# Altium schematic sheet HDMI_IN.SchDoc
size C
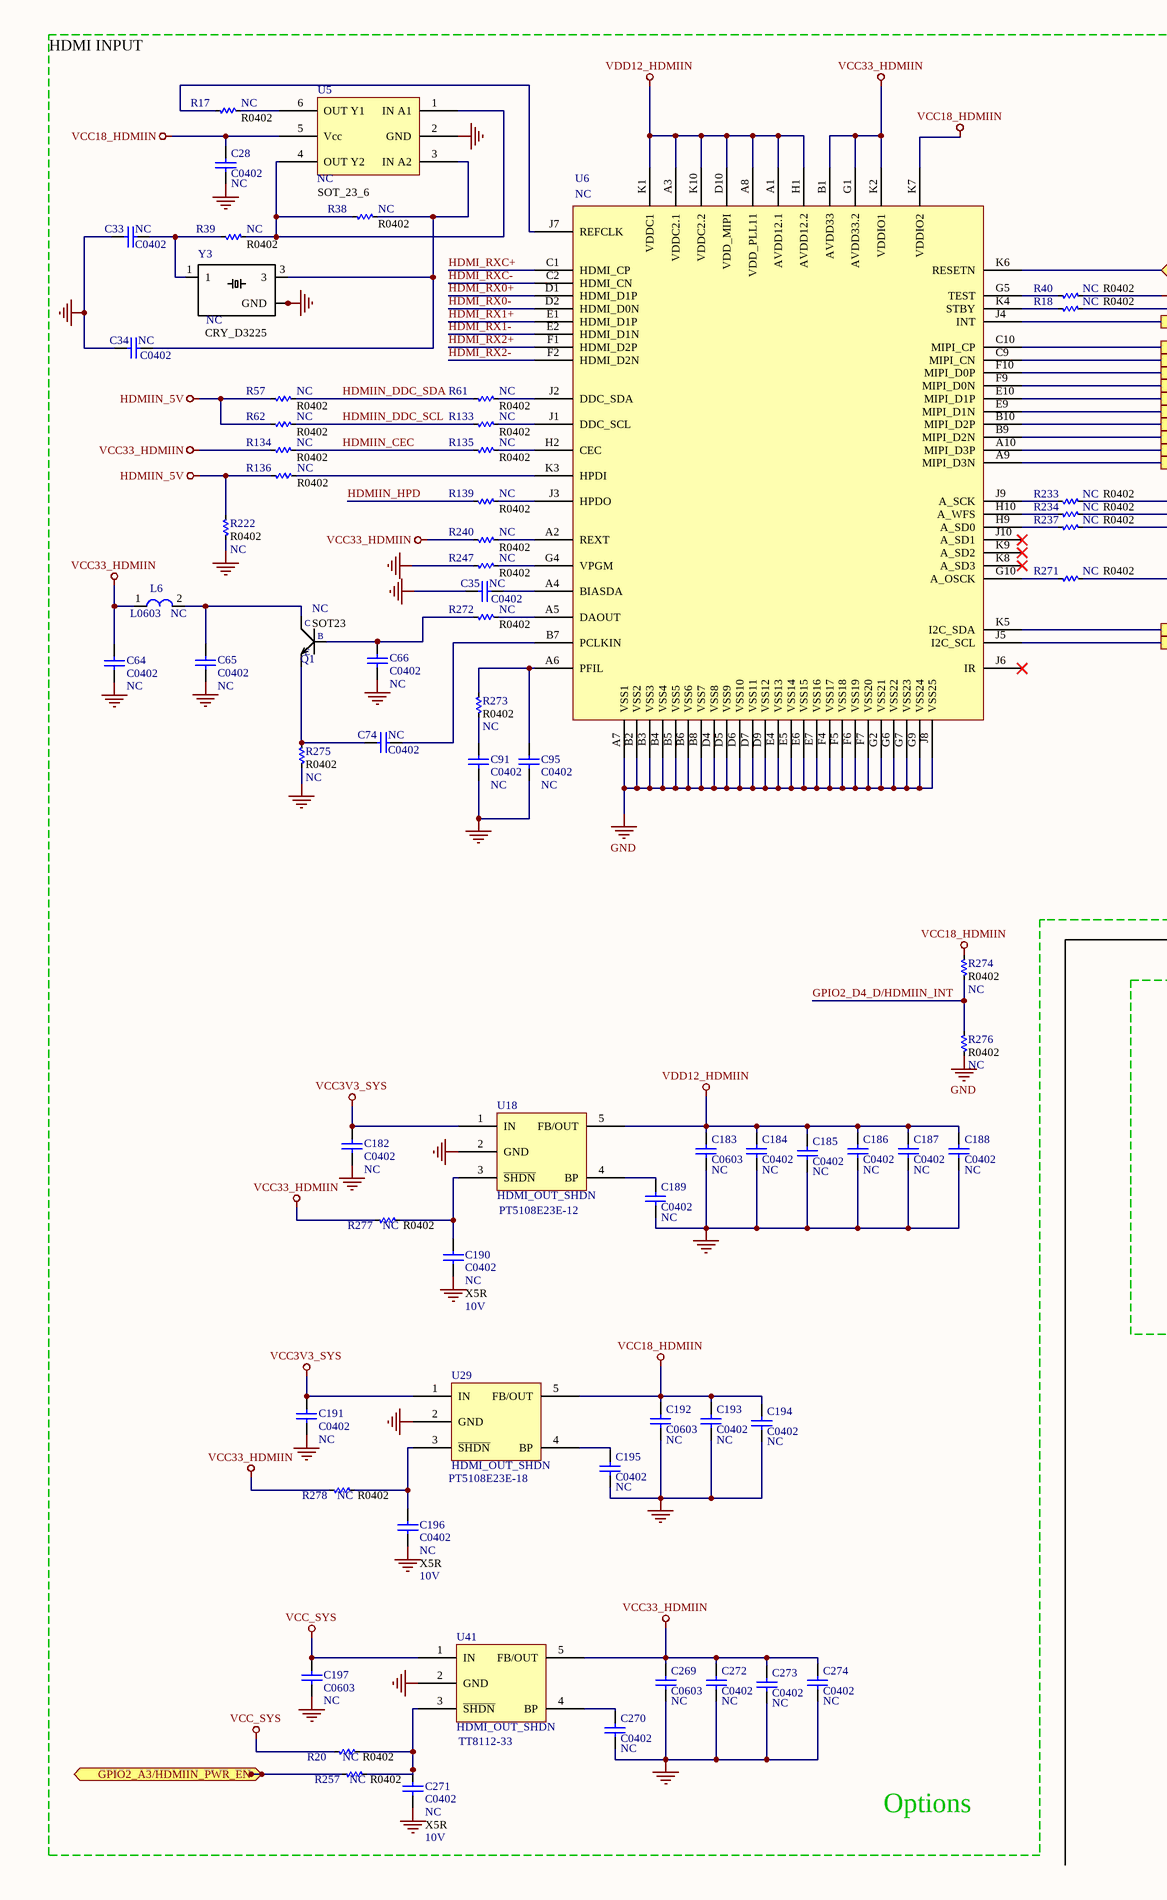
[diagram p0: HDMI_IN.SchDoc, left]
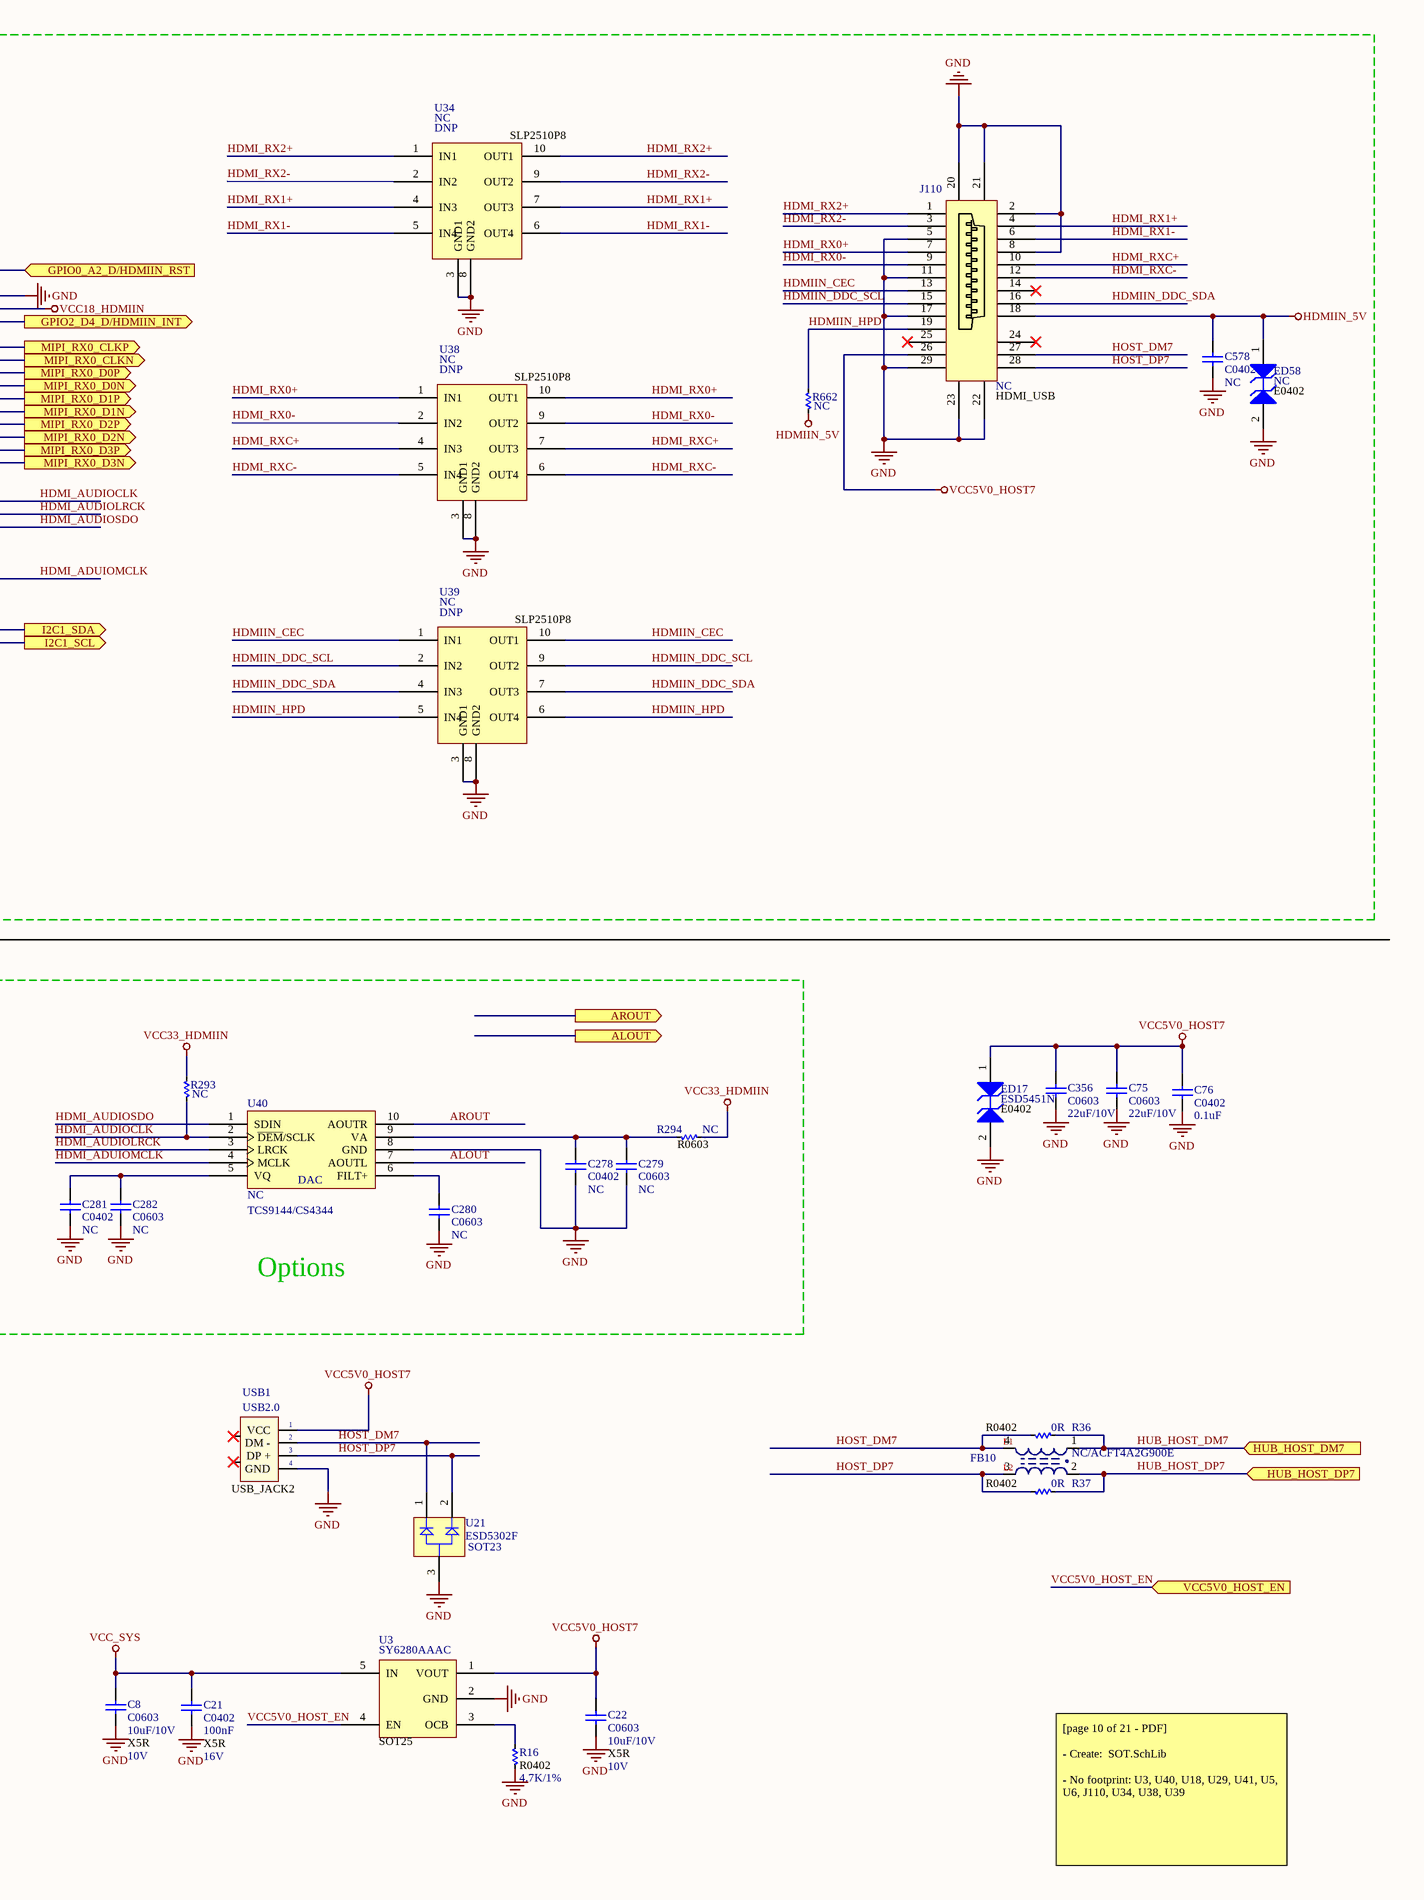
[diagram p1: HDMI_IN.SchDoc, right]

## Parts
C8  C0603  value 10uF/10V  [C 0603]
C21  C0402  value 100nF  [C 0402]
C22  C0603  value 10uF/10V  [C 0603]
C28  C0402  value NC  [C 0402]
C33  C0402  value NC  [C 0402]
C34  C0402  value NC  [C 0402]
C35  C0402  value NC  [C 0402]
C64  C0402  value NC  [C 0402]
C65  C0402  value NC  [C 0402]
C66  C0402  value NC  [C 0402]
C74  C0402  value NC  [C 0402]
C75  C0603  value 22uF/10V  [C 0603]
C76  C0402  value 0.1uF  [C 0402]
C91  C0402  value NC  [C 0402]
C95  C0402  value NC  [C 0402]
C182  C0402  value NC  [C 0402]
C183  C0603  value NC  [C 0603]
C184  C0402  value NC  [C 0402]
C185  C0402  value NC  [C 0402]
C186  C0402  value NC  [C 0402]
C187  C0402  value NC  [C 0402]
C188  C0402  value NC  [C 0402]
C189  C0402  value NC  [C 0402]
C190  C0402  value NC  [C 0402]
C191  C0402  value NC  [C 0402]
C192  C0603  value NC  [C 0603]
C193  C0402  value NC  [C 0402]
C194  C0402  value NC  [C 0402]
C195  C0402  value NC  [C 0402]
C196  C0402  value NC  [C 0402]
C197  C0603  value NC  [C 0603]
C269  C0603  value NC  [C 0603]
C270  C0402  value NC  [C 0402]
C271  C0402  value NC  [C 0402]
C272  C0402  value NC  [C 0402]
C273  C0402  value NC  [C 0402]
C274  C0402  value NC  [C 0402]
C278  C0402  value NC  [C 0402]
C279  C0603  value NC  [C 0603]
C280  C0603  value NC  [C 0603]
C281  C0402  value NC  [C 0402]
C282  C0603  value NC  [C 0603]
C356  C0603  value 22uF/10V  [C 0603]
C578  C0402  value NC  [C 0402]
ED17  ESD5451N  [DFN1006-2L]
ED58  ESD5451N  [DFN1006-2L]  (value not drawn)
FB10  RP2_0405  [L-SMD-D-7.3x7.3]  (value not drawn)
J110  HDMI_USB  value NC
L6  L0603  Inductance: NC  [L-SMD-M-12x10]
Q1  value NC  [*SOT-23]  (hidden comment: 8050)
R16  R0402  value 4.7K/1%  [R 0402]
R17  R0402  value NC  [R 0402]
R18  R0402  value NC  [R 0402]
R20  R0402  value NC  [R 0402]
R36  R0402  value 0R  [R 0402]
R37  R0402  value 0R  [R 0402]
R38  R0402  value NC  [R 0402]
R39  R0402  value NC  [R 0402]
R40  R0402  value NC  [R 0402]
R57  R0402  value NC  [R 0402]
R61  R0402  value NC  [R 0402]
R62  R0402  value NC  [R 0402]
R133  R0402  value NC  [R 0402]
R134  R0402  value NC  [R 0402]
R135  R0402  value NC  [R 0402]
R136  R0402  value NC  [R 0402]
R139  R0402  value NC  [R 0402]
R222  R0402  value NC  [R 0402]
R233  R0402  value NC  [R 0402]
R234  R0402  value NC  [R 0402]
R237  R0402  value NC  [R 0402]
R240  R0402  value NC  [R 0402]
R247  R0402  value NC  [R 0402]
R257  R0402  value NC  [R 0402]
R271  R0402  value NC  [R 0402]
R272  R0402  value NC  [R 0402]
R273  R0402  value NC  [R 0402]
R274  R0402  value NC  [R 0402]
R275  R0402  value NC  [R 0402]
R276  R0402  value NC  [R 0402]
R277  R0402  value NC  [R 0402]
R278  R0402  value NC  [R 0402]
R293  value NC  [R 0402]  (hidden comment: R0402)
R294  R0603  value NC  [R 0603]
R662  value NC  [R 0402]  (hidden comment: R0402)
U3  SY6280AAAC  Package: SOT25  [DCK5_N]
U5  value NC  Package: SOT_23_6  [SOT-23-6]  (hidden comment: HDMI_IN_SOT236)
U6  value NC  [TC358749XBG-80pin]  (hidden comment: HDMI_IN)
U18  HDMI_OUT_SHDN  [TI-DDC5_N]
U21  ESD5302F  PackageReference: SOT23  [INF-SOT23_N]
U29  HDMI_OUT_SHDN  [TI-DDC5_N]
U34  NC  [RCLAMP0524PATCT]
U38  NC  [RCLAMP0524PATCT]
U39  NC  [RCLAMP0524PATCT]
U40  DAC  value NC  [TSSOP-10]
U41  HDMI_OUT_SHDN  [TI-DDC5_N]
USB1  value USB2.0  [USB-S1]  (hidden comment: USB-S)
Y3  NC  [Crystal 4-SMD 32x25]

## Blocks framed on the sheet
Options: C28 C33-C35 C64-C66 C74 C91 C95 C182-C197 C269-C274 C578 ED58 J110 L6 Q1 R17 R18 R20 R38-R40 R57 R61 R62 R133-R136 R139 R222 R233 R234 R237 R240 R247 R257 R271-R278 R662 U5 U6 U18 U29 U34 U38 U39 U41 Y3
Options: C278-C282 R293 R294 U40

## Ports
ALOUT (out), AROUT (out), GPIO0_A2_D/HDMIIN_RST (in), GPIO2_A3/HDMIIN_PWR_EN (in), GPIO2_D4_D/HDMIIN_INT (out), HUB_HOST_DM7 (in), HUB_HOST_DP7 (in), I2C1_SCL (out), I2C1_SDA (out), MIPI_RX0_CLKN (out), MIPI_RX0_CLKP (out), MIPI_RX0_D0N (out), MIPI_RX0_D0P (out), MIPI_RX0_D1N (out), MIPI_RX0_D1P (out), MIPI_RX0_D2N (out), MIPI_RX0_D2P (out), MIPI_RX0_D3N (out), MIPI_RX0_D3P (out), VCC5V0_HOST_EN (in)

## Nets
GND: C8.2 C21.2 C22.2 C28.2 C33.1 C34.1 C35.1 C64.1 C65.1 C66.1 C75.2 C76.2 C91.1 C95.1 C182.2 C183.2 C184.2 C185.2 C186.2 C187.2 C188.2 C189.2 C190.2 C191.2 C192.2 C193.2 C194.2 C195.2 C196.2 C197.2 C269.2 C270.2 C271.2 C272.2 C273.2 C274.2 C278.2 C279.2 C280.2 C281.2 C282.2 C356.2 C578.2 ED17.2(A2) ED58.2(A2) J110.2 J110.5 J110.8 J110.11 J110.17 J110.20 J110.21 J110.22 J110.23 J110.29 R16.1 R40.2 R222.1 R247.1 R275.1 R276.2 U3.2(GND) U5.2(GND) U6.A7(VSS1) U6.B2(VSS2) U6.B3(VSS3) U6.B4(VSS4) U6.B5(VSS5) U6.B6(VSS6) U6.B8(VSS7) U6.D4(VSS8) U6.D5(VSS9) U6.D6(VSS10) U6.D7(VSS11) U6.D9(VSS12) U6.E4(VSS13) U6.E5(VSS14) U6.E6(VSS15) U6.E7(VSS16) U6.F4(VSS17) U6.F5(VSS18) U6.F6(VSS19) U6.F7(VSS20) U6.G2(VSS21) U6.G6(VSS22) U6.G7(VSS23) U6.G9(VSS24) U6.J8(VSS25) U18.2(GND) U21.3(A) U29.2(GND) U34.3(GND1) U34.8(GND2) U38.3(GND1) U38.8(GND2) U39.3(GND1) U39.8(GND2) U40.8(GND) U41.2(GND) USB1.4(GND) Y3.2(GND) Y3.4(GND)
HDMIIN_5V: C578.1 ED58.1(A1) J110.18 R57.1 R62.1 R136.1 R222.2 R662.1
VCC3V3_SYS: C182.1 C191.1 U18.1(IN) U29.1(IN)
VCC5V0_HOST7: C22.1 C75.1 C76.1 C356.1 ED17.1(A1) J110.26 U3.1(VOUT) USB1.1(VCC)
VCC18_HDMIIN: C28.1 C192.1 C193.1 C194.1 R18.2 R274.1 U5.5(Vcc) U6.K7(VDDIO2) U29.5(FB/OUT)
VCC33_HDMIIN: C64.2 C269.1 C272.1 C273.1 C274.1 L6.1 R134.1 R240.1 R277.2 R278.2 R293.2 R294.1 U6.B1(AVDD33) U6.G1(AVDD33.2) U6.K2(VDDIO1) U41.5(FB/OUT)
VCC_SYS: C8.1 C21.1 C197.1 R20.2 U3.5(IN) U41.1(IN)
VDD12_HDMIIN: C183.1 C184.1 C185.1 C186.1 C187.1 C188.1 U6.A1(AVDD12.1) U6.A3(VDDC2.1) U6.A8(VDD_PLL11) U6.D10(VDD_MIPI) U6.H1(AVDD12.2) U6.K1(VDDC1) U6.K10(VDDC2.2) U18.5(FB/OUT)
ALOUT: U40.7(AOUTL)
AROUT: U40.10(AOUTR)
GPIO0_A2_D/HDMIIN_RST: U6.K6(RESETN) ; port GPIO0_A2_D/HDMIIN_RST
GPIO2_A3/HDMIIN_PWR_EN: R257.2 ; port GPIO2_A3/HDMIIN_PWR_EN
GPIO2_D4_D/HDMIIN_INT: U6.J4(INT) ; port GPIO2_D4_D/HDMIIN_INT
GPIO2_D4_D/HDMIIN_INT: R274.2 R276.1  [a separate net that carries the same name]
HDMI_ADUIOMCLK: R271.2 U40.4(MCLK)
HDMI_AUDIOCLK: R233.2 R293.1 U40.2(~{DEM}/SCLK)
HDMI_AUDIOLRCK: R234.2 U40.3(LRCK)
HDMI_AUDIOSDO: R237.2 U40.1(SDIN)
HDMI_RX0+: J110.7 U6.D1(HDMI_D1P) U38.1(IN1) U38.10(OUT1)
HDMI_RX0-: J110.9 U6.D2(HDMI_D0N) U38.2(IN2) U38.9(OUT2)
HDMI_RX1+: J110.4 U6.E1(HDMI_D1P) U34.4(IN3) U34.7(OUT3)
HDMI_RX1-: J110.6 U6.E2(HDMI_D1N) U34.5(IN4) U34.6(OUT4)
HDMI_RX2+: J110.1 U6.F1(HDMI_D2P) U34.1(IN1) U34.10(OUT1)
HDMI_RX2-: J110.3 U6.F2(HDMI_D2N) U34.2(IN2) U34.9(OUT2)
HDMI_RXC+: J110.10 U6.C1(HDMI_CP) U38.4(IN3) U38.7(OUT3)
HDMI_RXC-: J110.12 U6.C2(HDMI_CN) U38.5(IN4) U38.6(OUT4)
HDMIIN_CEC: J110.13 R134.2 R135.1 U39.1(IN1) U39.10(OUT1)
HDMIIN_DDC_SCL: J110.15 R62.2 R133.1 U39.2(IN2) U39.9(OUT2)
HDMIIN_DDC_SDA: J110.16 R57.2 R61.1 U39.4(IN3) U39.7(OUT3)
HDMIIN_HPD: J110.19 R139.1 R662.2 U39.5(IN4) U39.6(OUT4)
HOST_DM7: FB10.4 J110.27 R36.1 U21.1(K1) USB1.2(DM_-)
HOST_DP7: FB10.3 J110.28 R37.1 U21.2(K2) USB1.3(DP_+)
HUB_HOST_DM7: FB10.1 R36.2 ; port HUB_HOST_DM7
HUB_HOST_DP7: FB10.2 R37.2 ; port HUB_HOST_DP7
I2C1_SCL: U6.J5(I2C_SCL) ; port I2C1_SCL
I2C1_SDA: U6.K5(I2C_SDA) ; port I2C1_SDA
MIPI_RX0_CLKN: U6.C9(MIPI_CN) ; port MIPI_RX0_CLKN
MIPI_RX0_CLKP: U6.C10(MIPI_CP) ; port MIPI_RX0_CLKP
MIPI_RX0_D0N: U6.F9(MIPI_D0N) ; port MIPI_RX0_D0N
MIPI_RX0_D0P: U6.F10(MIPI_D0P) ; port MIPI_RX0_D0P
MIPI_RX0_D1N: U6.E9(MIPI_D1N) ; port MIPI_RX0_D1N
MIPI_RX0_D1P: U6.E10(MIPI_D1P) ; port MIPI_RX0_D1P
MIPI_RX0_D2N: U6.B9(MIPI_D2N) ; port MIPI_RX0_D2N
MIPI_RX0_D2P: U6.B10(MIPI_D2P) ; port MIPI_RX0_D2P
MIPI_RX0_D3N: U6.A9(MIPI_D3N) ; port MIPI_RX0_D3N
MIPI_RX0_D3P: U6.A10(MIPI_D3P) ; port MIPI_RX0_D3P
VCC5V0_HOST_EN: U3.4(EN) ; port VCC5V0_HOST_EN
NetC33_2: C33.2 R39.1 Y3.1
NetC34_2: C34.2 R38.2 U5.3(IN_A2) Y3.3
NetC35_2: C35.2 U6.A4(BIASDA)
NetC65_2: C65.2 L6.2 Q1.3(C)
NetC66_2: C66.2 Q1.1(B) R272.1
NetC74_1: C74.1 U6.B7(PCLKIN)
NetC74_2: C74.2 Q1.2(E) R275.2
NetC91_2: C91.2 R273.1
NetC95_2: C95.2 R273.2 U6.A6(PFIL)
NetC189_1: C189.1 U18.4(BP)
NetC190_1: C190.1 R277.1 U18.3(~{SHDN})
NetC195_1: C195.1 U29.4(BP)
NetC196_1: C196.1 R278.1 U29.3(~{SHDN})
NetC270_1: C270.1 U41.4(BP)
NetC271_1: C271.1 R20.1 R257.1 U41.3(~{SHDN})
NetC278_1: C278.1 C279.1 R294.2 U40.9(VA)
NetC280_1: C280.1 U40.6(FILT+)
NetC281_1: C281.1 C282.1 U40.5(VQ)
NetR16_2: R16.2 U3.3(OCB)
NetR17_1: R17.1 U6.J7(REFCLK)
NetR17_2: R17.2 U5.6(OUT_Y1)
NetR18_1: R18.1 U6.K4(STBY)
NetR38_1: R38.1 R39.2 U5.1(IN_A1) U5.4(OUT_Y2)
NetR40_1: R40.1 U6.G5(TEST)
NetR61_2: R61.2 U6.J2(DDC_SDA)
NetR133_2: R133.2 U6.J1(DDC_SCL)
NetR135_2: R135.2 U6.H2(CEC)
NetR136_2: R136.2 U6.K3(HPDI)
NetR139_2: R139.2 U6.J3(HPDO)
NetR233_1: R233.1 U6.J9(A_SCK)
NetR234_1: R234.1 U6.H10(A_WFS)
NetR237_1: R237.1 U6.H9(A_SD0)
NetR240_2: R240.2 U6.A2(REXT)
NetR247_2: R247.2 U6.G4(VPGM)
NetR271_1: R271.1 U6.G10(A_OSCK)
NetR272_2: R272.2 U6.A5(DAOUT)

Not connected (* = marked no-connect by the designer): J110 14* 24* 25*; U6 J6(IR)* J10(A_SD1)* K8(A_SD3)* K9(A_SD2)*; USB1 5* 6*

## Notes on the sheet
- HDMI INPUT
- [page 10 of 21 - PDF]
  - Create:  SOT.SchLib
  - No footprint: U3, U40, U18, U29, U41, U5, U6, J110, U34, U38, U39
- (in symbol 1SMB54CAT3) E0402; NC
- (in symbol ABM8-30.000MHZ-10-1-U-T) CRY_D3225
- (in symbol Cap) X5R; 10V; 16V
- (in symbol HDMI_OUT_DAC) TCS9144/CS4344
- (in symbol HDMI_OUT_SHDN) PT5108E23E-12; PT5108E23E-18; TT8112-33
- (in symbol L-SMD-2) L1; NC/ACFT4A2G900E; L2
- (in symbol SLP2510P8) DNP
- (in symbol SMD-TRANSISTORS-NPN-25V-500MW(SOT-23)) SOT23
- (in symbol USB_S) USB_JACK2

## Library data of the parts
C8 C21 C22 C28 C33-C35 C64-C66 C74-C76 C91 C95 C182-C197 C269-C274 C278-C282 C356 C578 = Cap: Capacitor; Published: 8-Jun-2000; LatestRevisionDate: 17-Jul-2002; LatestRevisionNote: Re-released for DXP Platform.; PackageReference: RAD-0.3; Publisher: Altium Limited; PackageDescription: Radial Cap, Thru-Hole; 2 Leads; 0.3 in Pin Spacing
ED17 ED58 = 1SMB54CAT3: 600 W Peak Power Zener Transient Voltage Suppressor, Bidirectional, 2-Pin SMB, Tape and Reel; Manufacturer: On Semiconductor; IR Max (uA): 5; PPK Max (W): 600; V(BR) Typ (V): 63.16; DatasheetVersion: Rev. A; PackageVersion: Rev. A, 01/2000; PackageReference: SMB-2-403C-01; PackageDescription: 2-Pin Small Molded Package, J-Bend Lead, Body 4.315 x 3.555 mm; Supplier 1: Digi-Key; Supplier Part Number 1: 1SMB54CAT3-ND; Direction: Bidirectional; Packing: Tape and Reel; Mounting Technology: Surface Mount; PartNumber: 1SMB54CAT3; ComponentLink1Description: Manufacturer URL; ComponentLink1URL: http://www.onsemi.com/; ComponentLink2Description: Datasheet; ComponentLink2URL: http://www.onsemi.com/pub_link/Collateral/1SMB10CAT3-D.PDF; ComponentLink3Description: Package Specification; ComponentLink3URL: http://www.onsemi.com/pub_link/Collateral/1SMB10CAT3-D.PDF
FB10 = L-SMD-2: partNo: 7448709022; Manufacturer: Würth Elektronik eiSos GmbH; Inductance: 2.20 µH; ComponentLink1Description: Manufacturer; ComponentLink1URL: http://www.we-online.de; Created by: Christin Otto; Created Date: August 2013; ComponentLink2Description: Datasheet; ComponentLink2URL: http://katalog.we-online.de/pbs/datasheet/7448709022.pdf
J110 = HDMI_IN_USB
L6 = L-SMD-1: partNo: 78477010; Manufacturer: Wurth Elektronik; ComponentLink1Description: Manufacturer; ComponentLink1URL: http://www.we-online.de; Created by: Baojun Chen; Created Date: Nov.2015; ComponentLink2Description: Datasheet; ComponentLink2URL: http://katalog.we-online.de/pbs/datasheet/78477010.pdf
Q1 = SMD-TRANSISTORS-NPN-25V-500MW(SOT-23): MF: Recom Power; MP: S8050; Package: SMD-8 Samsung; Price: None; SnapEDA_Link: https://www.snapeda.com/parts/S8050/Recom%20Power/view-part/?ref=snap; Availability: Unavailable
R16-R18 R20 R36-R40 R57 R61 R62 R133-R136 R139 R222 R233 R234 R237 R240 R247 R257 R271-R278 R293 R294 R662 = Res-SMD: Resistor; Manufacturer: Generic Components; Class: Passive; Published: 08/06/2000; Publisher: Altium Hobart Technology Centre
U21 = BAS70-06: Silicon Schottky Diode, -55 to 125 degC, SOT23, Reel, Green; Manufacturer: Infineon; Configuration: Dual; CT (max): 2 pF; Green: TRUE; IF (max): 70 mA; VF (max): 1,000 mV; VR (max): 70 V; PackageVersion: Apr-08; PackageDescription: 3-Pin Small Outline Transistor Package, 1.3 x 2.9 mm Body, 0.95 mm Pitch; Packing: Reel; Mounting Technology: Surface Mount; PartNumber: BAS70-06; ComponentLink1Description: Manufacturer URL; ComponentLink1URL: http://www.infineon.com/; ComponentLink2Description: Datasheet; ComponentLink2URL: http://www.infineon.com/dgdl/bas70_bas170series.pdf?folderId=db3a30431400ef68011425f1ca2505e3&fileId=db3a304314dca389011518ad41680e12; ComponentLink3Description: Package Specification; ComponentLink3URL: http://www.infineon.com/dgdl/SOT23-Package_Overview.pdf?folderId=db3a30431936bc4b0119532290053c66&fileId=db3a30431936bc4b0119533468123c85
U34 U38 U39 = SLP2510P8
U40 = HDMI_OUT_DAC
USB1 = USB_S: USB connector
Y3 = ABM8-30.000MHZ-10-1-U-T: Ultra Miniature Crystal, SMD Ceramic, 30.000MHZ, 10pF, 10ppm@25C, 10ppm -10+60C,; MF: Abracon; SnapEDA_Link: https://www.snapeda.com/parts/ABM8-30.000MHZ-10-1-U-T/Abracon%20LLC/view-part/?ref=snap; MP: ABM8-30.000MHZ-10-1-U-T; Availability: Unavailable; Price: None; Package: SMD-4 Abracon; Value: *